# Altium schematic sheet H-Bridge.SchDoc
size A4
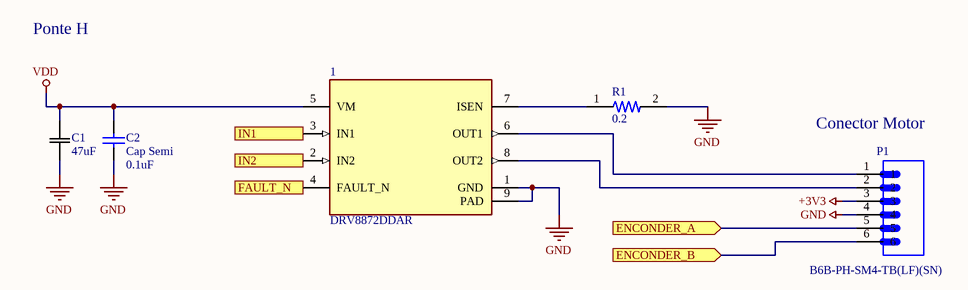
[diagram p0: H-Bridge.SchDoc]

## Parts
1  DRV8872DDAR  [DDA0008H_N]
C1  47uF  [CAP_UWF_6P3X5P00]
C2  Cap Semi  value 0.1uF  [1608[0603]]
P1  B6B-PH-SM4-TB(LF)(SN)  [JST_B6B-PH-SM4-TB(LF)(SN)]
R1  0.2  [RESC1607X60N]

## Ports
ENCONDER_A (in), ENCONDER_B (in), FAULT_N (out), IN1 (in), IN2 (in)

## Nets
+3V3: P1.3
GND: 1.1(GND) 1.9(PAD) C1.1 C2.1 P1.4 R1.2
VDD: 1.5(VM) C1.2 C2.2
ENCONDER_A: P1.5 ; port ENCONDER_A
ENCONDER_B: P1.6 ; port ENCONDER_B
FAULT_N: 1.4(FAULT_N) ; port FAULT_N
IN1: 1.3(IN1) ; port IN1
IN2: 1.2(IN2) ; port IN2
Net1_6: 1.6(OUT1) P1.1
Net1_7: 1.7(ISEN) R1.1
Net1_8: 1.8(OUT2) P1.2

## Notes on the sheet
- Ponte H
- (near P1) Conector Motor

## Library data of the parts
1 = DRV8872DDAR: Unipolar Motor Driver NMOS PWM 8-SO PowerPad; MF: Texas Instruments; Price: None; Package: SO-8 Texas Instruments; MP: DRV8872DDAR; Value: *; Availability: Unavailable; SnapEDA_Link: https://www.snapeda.com/parts/DRV8872DDAR/Texas%20Instruments/view-part/561864/?ref=snap
C1 = UWR1E470MCL1GB: No Description Available; Vendor: Nichicon; Built_By: EMA_Cory; SourceLibrary: Nichicon_2019-09-13; Type: DEV; Manufacturer_Part_Number: UWR1E470MCL1GB; Copyright: Copyright (C) 2018 Accelerated Designs. All rights reserved; RefDes: RefDes
C2 = Cap Semi: Capacitor (Semiconductor SIM Model); Published: 8-Jun-2000; LatestRevisionDate: 29-May-2009; LatestRevisionNote: IPC-7351 Footprint Added.; PackageReference: C1206; Publisher: Altium Limited; PackageDescription: Chip Capacitor
P1 = B6B-PH-SM4-TB(LF)(SN): Connector Header Surface Mount 6 position 0.079 _2.00mm_; MF: JST Sales; MP: B6B-PH-SM4-TB_LF__SN_; Value: *; Price: None; Package: None; SnapEDA_Link: https://www.snapeda.com/parts/B6B-PH-SM4-TB%28LF%29%28SN%29/JST%20Sales%20America%20Inc./view-part/52131/?ref=snap; Availability: Unavailable
R1 = RC0603JR-071KL: 1 kOhms Â±5% 0.1W, 1/10W Chip Resistor 0603 _1608 Metric_ Moisture Resistant Thick Film; MF: Yageo; Value: *; Package: 0603 Yageo; MP: RC0603JR-071KL; SnapEDA_Link: https://www.snapeda.com/parts/RC0603JR-071KL/Yageo/view-part/106141/?ref=snap; Digi-Key_Purchase_URL: https://www.digikey.co.nz/product-detail/en/yageo/RC0603JR-071KL/311-1.0KGRCT-ND/729624?utm_source=snapeda&utm_medium=aggregator&utm_campaign=symbol; Digi-Key_Part_Number: 311-1.0KGRCT-ND